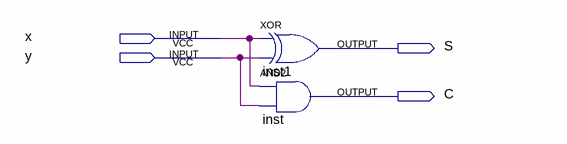
[diagram p0: schematic sheet]
// Quartus schematic half_adder.bdf as structural Verilog: 2 symbols, 4 pins
module half_adder (
  input  x,
  input  y,
  output S,
  output C
);

  xor inst1 (S, x, y);
  and inst (C, x, y);
endmodule
